# EAGLE design Focus_V8 (EAGLE 6.6.0)
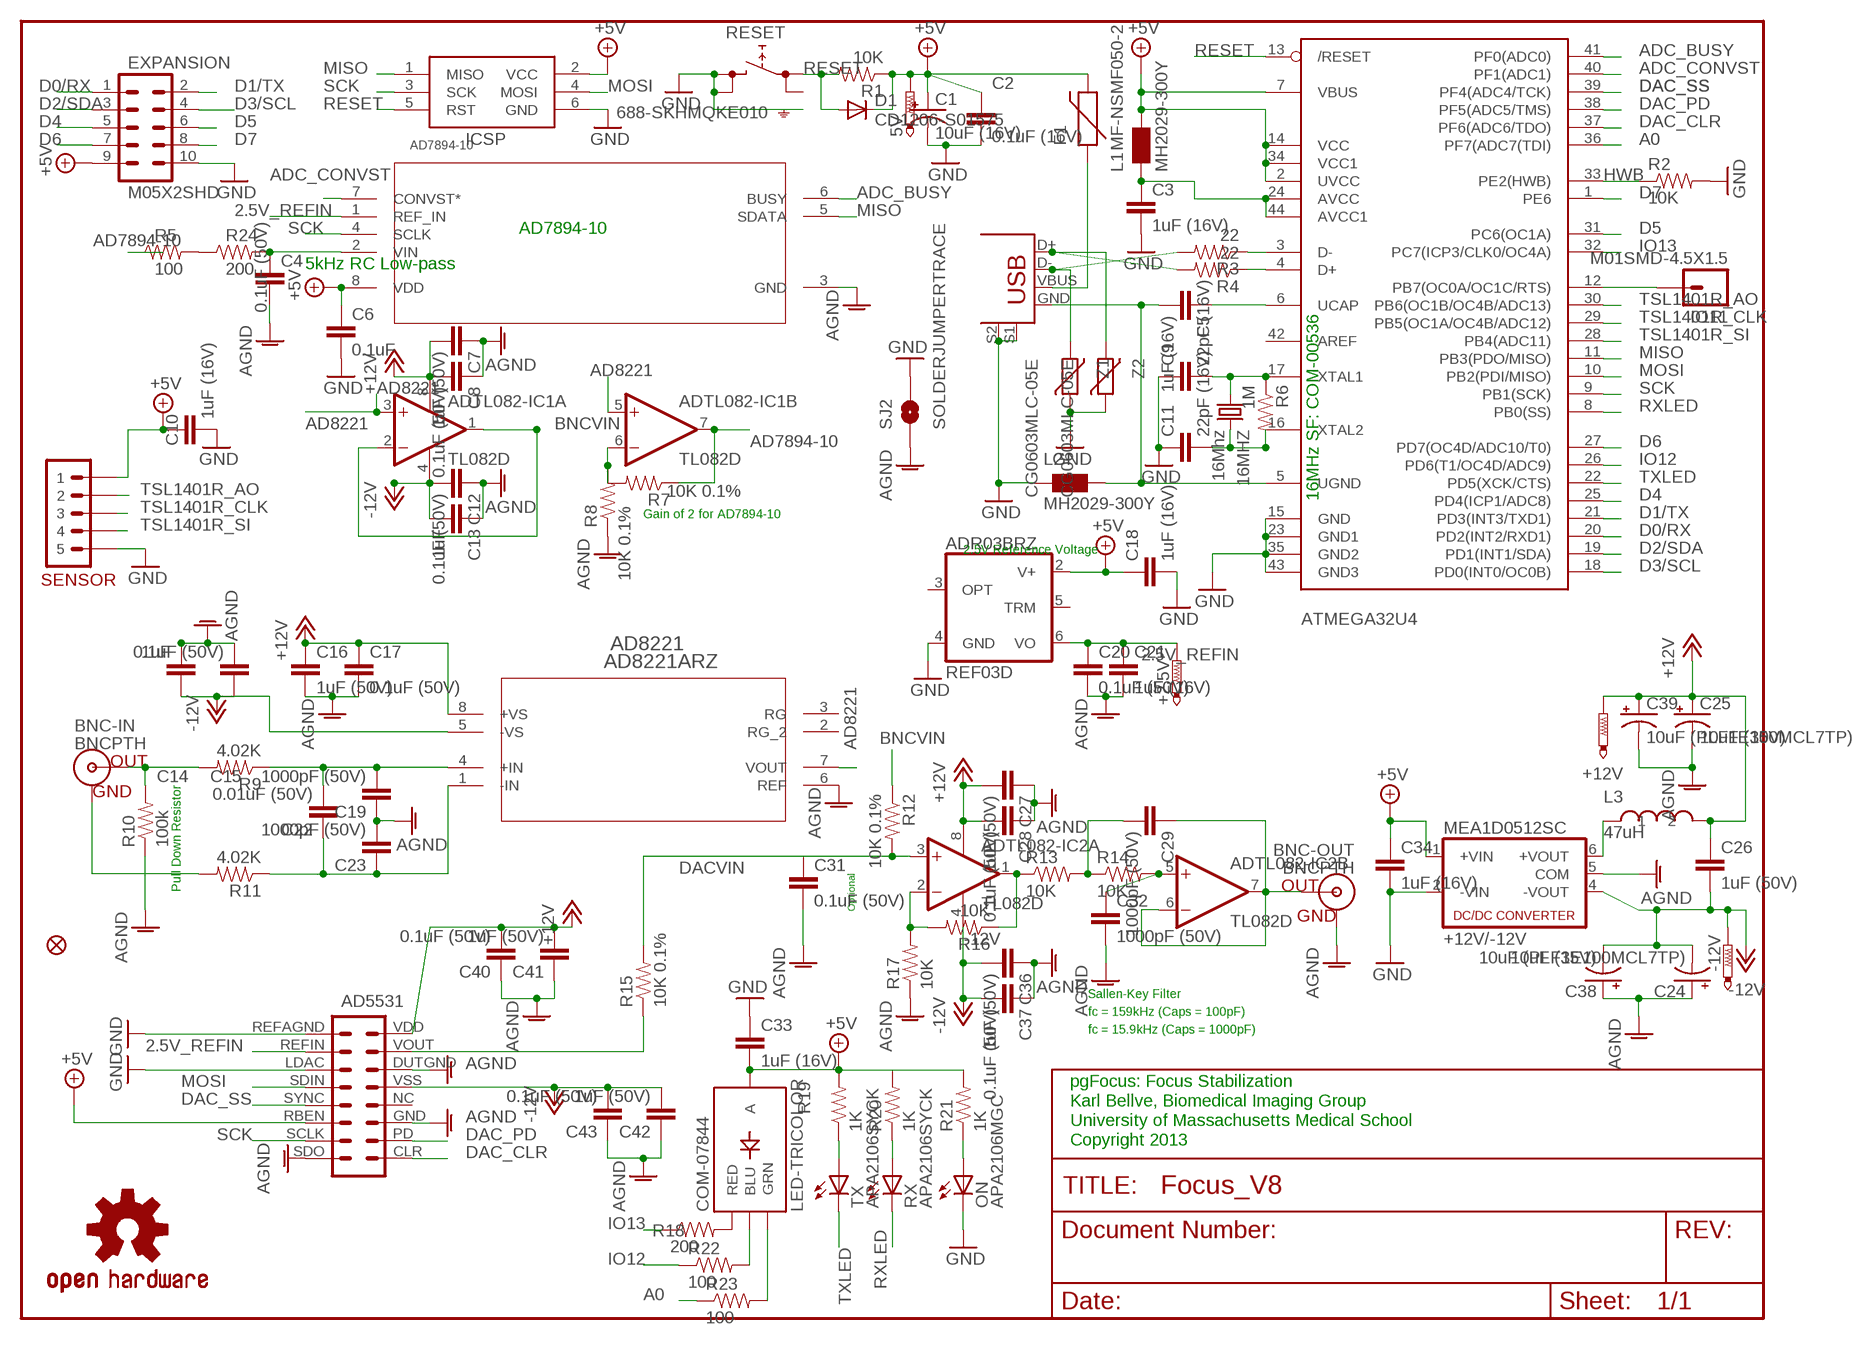
[diagram p0: schematic, sheet 1]

## Parts
5V  PTR1TP20R  [TP20R]
16MHZ  16Mhz  CRYSTALHC49UV  [HC49U-V]
+2.5V  PTR1TP20R  [TP20R]
+12V  PTR1TP20R  [TP20R]
-12V  PTR1TP20R  [TP20R]
AD7894-10  AD7894ARZ-10  AD7894ARZ-3  [R_8]
AD8221  AD8221ARZ  [R_8]
ADR03BRZ  REF03D  [SO08]
ADTL082-IC1  TL082D  [SO08]
ADTL082-IC2  TL082D  [SO08]
ATMEGA32U4  ATMEGA32U4-AU  [TQFP44]
BNC-IN  BNCPTH  [BNC]
BNC-OUT  BNCPTH  [BNC]
C1  10uF (16V)  CAP_POL1206-KIT  [EIA3216-KIT]
C2  0.1uF (16V)  CAP0603-CAP  [0603-CAP]
C3  1uF (16V)  CAP0603-CAP  [0603-CAP]
C4  0.1uF (50V)  CAP0603-CAP  [0603-CAP]
C5  1uF (16V)  CAP0603-CAP  [0603-CAP]
C6  0.1uF  CAP0603-CAP  [0603-CAP]
C7  1uF (50V)  CAP0603-CAP  [0603-CAP]
C8  0.1uF (50V)  CAP0603-CAP  [0603-CAP]
C9  22pF (16V)  CAP0603-CAP  [0603-CAP]
C10  1uF (16V)  CAP0603-CAP  [0603-CAP]
C11  22pF (16V)  CAP0603-CAP  [0603-CAP]
C12  0.1uF (50V)  CAP0603-CAP  [0603-CAP]
C13  1uF  CAP0603-CAP  [0603-CAP]
C14  1uF  CAP0603-CAP  [0603-CAP]
C15  0.1uF (50V)  CAP0603-CAP  [0603-CAP]
C16  1uF (50V)  CAP0603-CAP  [0603-CAP]
C17  0.1uF (50V)  CAP0603-CAP  [0603-CAP]
C18  1uF (16V)  CAP0603-CAP  [0603-CAP]
C19  1000pF (50V)  CAP0603-CAP  [0603-CAP]
C20  0.1uF (50V)  CAP0603-CAP  [0603-CAP]
C21  1uF (16V)  CAP0603-CAP  [0603-CAP]
C22  0.01uF (50V)  CAP0603-CAP  [0603-CAP]
C23  1000pF (50V)  CAP0603-CAP  [0603-CAP]
C24  10uF (PLF1E100MCL7TP)  CAP_POLPTH1  [CPOL-RADIAL-100UF-25V]
C25  10uF (35V)  CAP_POL1206-KIT  [EIA3216-KIT]
C26  1uF (50V)  CAP0603-CAP  [0603-CAP]
C27  1uF (50V)  CAP0603-CAP  [0603-CAP]
C28  0.1uF (50V)  CAP0603-CAP  [0603-CAP]
C29  1000pF (50V)  CAP0603-CAP  [0603-CAP]
C31  0.1uF (50V)  CAP0603-CAP  [0603-CAP]
C32  1000pF (50V)  CAP0603-CAP  [0603-CAP]
C33  1uF (16V)  CAP0603-CAP  [0603-CAP]
C34  1uF (16V)  CAP0603-CAP  [0603-CAP]
C36  1uF (50V)  CAP0603-CAP  [0603-CAP]
C37  0.1uF (50V)  CAP0603-CAP  [0603-CAP]
C38  10uF (35V)  CAP_POL1206-KIT  [EIA3216-KIT]
C39  10uF (PLF1E100MCL7TP)  CAP_POLPTH1  [CPOL-RADIAL-100UF-25V]
C40  0.1uF (50V)  CAP0603-CAP  [0603-CAP]
C41  1uF (50V)  CAP0603-CAP  [0603-CAP]
C42  1uF (50V)  CAP0603-CAP  [0603-CAP]
C43  0.1uF (50V)  CAP0603-CAP  [0603-CAP]
COM-07844  LED-TRICOLOR  [LED-TRICOLOR-SMD]
D1  CD1206-S01575  DIODE-MINIMELF  [MINIMELF]
EXPANSION  M05X2SHD  [2X5-SHROUDED]
F1  MF-NSMF050-2  PTCSMD  [PTC-1206]
ICSP  AVRISP-6  [AVRISP]
IO11  M01SMD-4.5X1.5  [PAD-1.5X4.5]
JP1  FIDUCIAL1.5X3  [FIDUCIAL-1.5X3]
L1  MH2029-300Y  WE-CBF_0805  [0805]
L2  MH2029-300Y  WE-CBF_0805  [0805]
L3  47uH  11R473C  [11R473C]
MEA1D0512SC  +12V/-12V  NMA  [NMA]
ON  APA2106MGC  LEDCHIPLED_0805  [CHIPLED_0805]
R1  10K  RESISTOR0603-RES  [0603-RES]
R2  10K  RESISTOR0603-RES  [0603-RES]
R3  22  RESISTOR0603-RES  [0603-RES]
R4  22  RESISTOR0603-RES  [0603-RES]
R5  100  RESISTOR0603-RES  [0603-RES]
R6  1M  RESISTOR0603-RES  [0603-RES]
R7  10K 0.1%  RESISTOR0603-RES  [0603-RES]
R8  10K 0.1%  RESISTOR0603-RES  [0603-RES]
R9  4.02K  RESISTOR0603-RES  [0603-RES]
R10  100k  RESISTOR0603-RES  [0603-RES]
R11  4.02K  RESISTOR0603-RES  [0603-RES]
R12  10K 0.1%  RESISTOR0603-RES  [0603-RES]
R13  10K  RESISTOR0603-RES  [0603-RES]
R14  10K  RESISTOR0603-RES  [0603-RES]
R15  10K 0.1%  RESISTOR0603-RES  [0603-RES]
R16  10K  RESISTOR0603-RES  [0603-RES]
R17  10K  RESISTOR0603-RES  [0603-RES]
R18  200  RESISTOR0603-RES  [0603-RES]
R19  1K  RESISTOR0603-RES  [0603-RES]
R20  1K  RESISTOR0603-RES  [0603-RES]
R21  1K  RESISTOR0603-RES  [0603-RES]
R22  100  RESISTOR0603-RES  [0603-RES]
R23  100  RESISTOR0603-RES  [0603-RES]
R24  200  RESISTOR0603-RES  [0603-RES]
RESET  688-SKHMQKE010  SKHMPSE010  [SKHMPXE010]
RX  APA2106SYCK  LEDCHIPLED_0805  [CHIPLED_0805]
SENSOR  M05  [M05JST-PTH]
SJ2  SOLDERJUMPERTRACE  [SJ_2S-TRACE]
TX  APA2106SYCK  LEDCHIPLED_0805  [CHIPLED_0805]
U$1  AD5531  AD5331  [AD5531]
U$3  OSHW-LOGOL  [OSHW-LOGO-L]
USB  USB+SHIELD  [USB-B-PTH]
Z1  CG0603MLC-05E  VARISTORCN0603  [CT/CN0603]
Z2  CG0603MLC-05E  VARISTORCN0603  [CT/CN0603]

## Nets
2.5V_REFIN: +2.5V.TP AD7894-10.1(REF_IN) ADR03BRZ.6(VO) C20.1 C21.1 U$1.REFIN
+5V: 5V.TP AD7894-10.8(VDD) ADR03BRZ.2(V+) ATMEGA32U4.2(UVCC) ATMEGA32U4.7(VBUS) ATMEGA32U4.14(VCC) ATMEGA32U4.34(VCC1) C1.A(+) C2.1 C6.1 C10.1 C18.1 C33.2 C34.1 COM-07844.A D1.C EXPANSION.9 F1.2 ICSP.2(VCC) L1.2 MEA1D0512SC.1(+VIN) R1.1 R19.2 R20.2 R21.2 SENSOR.P$1 U$1.RBEN
+12V: +12V.TP AD8221.8(+VS) ADTL082-IC1.8(P:V+) ADTL082-IC2.8(P:V+) C7.2 C8.2 C16.1 C17.1 C25.A(+) C26.1 C27.2 C28.2 C39.1(+) C40.2 C41.2 L3.P$2 U$1.VDD
-12V: -12V.TP AD8221.5(-VS) ADTL082-IC1.4(P:V-) ADTL082-IC2.4(P:V-) C12.2 C13.2 C14.1 C15.1 C24.2(-) C26.2 C36.2 C37.2 C38.C(-) C42.2 C43.2 MEA1D0512SC.4(-VOUT) U$1.VSS
A0: ATMEGA32U4.36(PF7(ADC7(TDI)) R23.1
AD7894-10: ADTL082-IC1.7(B:OUT) R5.1 R7.1
AD8221: AD8221.7(VOUT) ADTL082-IC1.3(A:+IN) ADTL082-IC1.5(B:+IN)
ADC_BUSY: AD7894-10.6(BUSY) ATMEGA32U4.41(PF0(ADC0))
ADC_CONVST: AD7894-10.7(CONVST*) ATMEGA32U4.40(PF1(ADC1))
AGND: AD7894-10.3(GND) AD8221.6(REF) BNC-OUT.GND C4.2 C7.1 C8.1 C12.1 C13.1 C14.2 C15.2 C16.2 C17.2 C19.1 C20.2 C21.2 C23.2 C24.1(+) C25.C(-) C27.1 C28.1 C31.2 C32.2 C36.1 C37.1 C38.A(+) C39.2(-) C40.1 C41.1 C42.1 C43.1 MEA1D0512SC.5(COM) R8.1 R10.1 R17.1 SJ2.1 U$1.DUTGND U$1.GND U$1.SDO
BNCVIN: ADTL082-IC1.1(A:OUT) ADTL082-IC1.2(A:-IN) R12.1
D0/RX: ATMEGA32U4.20(PD2(INT2/RXD1)) EXPANSION.1
D1/TX: ATMEGA32U4.21(PD3(INT3/TXD1)) EXPANSION.2
D2/SDA: ATMEGA32U4.19(PD1(INT1/SDA)) EXPANSION.3
D3/SCL: ATMEGA32U4.18(PD0(INT0/OC0B)) EXPANSION.4
D4: ATMEGA32U4.25(PD4(ICP1/ADC8)) EXPANSION.5
D5: ATMEGA32U4.31(PC6(OC1A)) EXPANSION.6
D6: ATMEGA32U4.27(PD7(OC4D/ADC10/T0)) EXPANSION.7
D7: ATMEGA32U4.1(PE6) EXPANSION.8
DAC_CLR: ATMEGA32U4.37(PF6(ADC6/TDO)) U$1.CLR
DAC_PD: ATMEGA32U4.38(PF5(ADC5/TMS)) U$1.PD
DAC_SS: ATMEGA32U4.39(PF4(ADC4/TCK)) U$1.SYNC
DACVIN: ADTL082-IC2.3(A:+IN) C31.1 R12.2 R15.2
GND: ADR03BRZ.4(GND) ATMEGA32U4.15(GND) ATMEGA32U4.23(GND1) ATMEGA32U4.35(GND2) ATMEGA32U4.43(GND3) C1.C(-) C2.2 C3.2 C6.2 C9.1 C10.2 C11.1 C18.2 C33.1 C34.2 EXPANSION.10 ICSP.6(GND) L2.1 MEA1D0512SC.2(-VIN) ON.CATHODE(C) R2.2 RESET.3(2.1) RESET.4(2.2) RESET.5(SH) SENSOR.P$5 SJ2.2 U$1.LDAC U$1.REFAGND USB.S1 USB.S2 Z1.1 Z2.1
HWB: ATMEGA32U4.33(PE2(HWB)) R2.1
IO12: ATMEGA32U4.26(PD6(T1/OC4D/ADC9)) R22.1
IO13: ATMEGA32U4.32(PC7(ICP3/CLK0/OC4A)) R18.1
MISO: AD7894-10.5(SDATA) ATMEGA32U4.11(PB3(PDO/MISO)) ICSP.1(MISO)
MOSI: ATMEGA32U4.10(PB2(PDI/MISO)) ICSP.4(MOSI) U$1.SDIN
N$1: ADTL082-IC2.2(A:-IN) R16.2 R17.2
N$2: ADTL082-IC2.5(B:+IN) C32.1 R14.2
N$3: AD7894-10.2(VIN) C4.1 R24.2
N$4: AD8221.1(-IN) C22.1 C23.1 R11.1
N$5: R5.2 R24.1
N$6: L3.P$1 MEA1D0512SC.6(+VOUT)
N$7: ADTL082-IC2.1(A:OUT) R13.1 R16.1
N$8: R15.1 U$1.VOUT
N$9: R19.1 TX.ANODE(A)
N$10: ATMEGA32U4.4(D+) R4.1
N$11: 16MHZ.1 ATMEGA32U4.17(XTAL1) C9.2 R6.1
N$12: R20.1 RX.ANODE(A)
N$13: BNC-IN.GND R11.2
N$14: AD8221.4(+IN) C19.2 C22.2 R9.1
N$15: ATMEGA32U4.6(UCAP) C5.1
N$16: C29.2 R13.2 R14.1
N$17: BNC-IN.S(OUT) R9.2 R10.2
N$18: ADTL082-IC1.6(B:-IN) R7.2 R8.2
N$19: R3.2 USB.D- Z1.2
N$20: ATMEGA32U4.3(D-) R3.1
N$21: R4.2 USB.D+ Z2.2
N$22: F1.1 USB.VBUS
N$23: ADTL082-IC2.6(B:-IN) ADTL082-IC2.7(B:OUT) BNC-OUT.S(OUT) C29.1
N$24: ON.ANODE(A) R21.1
N$25: ATMEGA32U4.24(AVCC) ATMEGA32U4.44(AVCC1) C3.1 L1.1
N$26: 16MHZ.2 ATMEGA32U4.16(XTAL2) C11.2 R6.2
N$28: ATMEGA32U4.12(PB7(OC0A/OC1C/RTS)) IO11.P$1
N$29: COM-07844.R(RED) R18.2
N$30: COM-07844.B(BLU) R22.2
N$31: COM-07844.G(GRN) R23.2
RESET: ATMEGA32U4.13(/RESET) D1.A ICSP.5(RST) R1.2 RESET.1(1.1)
RXLED: ATMEGA32U4.8(PB0(SS)) RX.CATHODE(C)
SCK: AD7894-10.4(SCLK) ATMEGA32U4.9(PB1(SCK)) ICSP.3(SCK) U$1.SCLK
TSL1401R_AO: ATMEGA32U4.30(PB6(OC1B/OC4B/ADC13)) SENSOR.P$2
TSL1401R_CLK: ATMEGA32U4.29(PB5(OC1A/OC4B/ADC12)) SENSOR.P$3
TSL1401R_SI: ATMEGA32U4.28(PB4(ADC11)) SENSOR.P$4
TXLED: ATMEGA32U4.22(PD5(XCK/CTS)) TX.CATHODE(C)
UGND: ATMEGA32U4.5(UGND) C5.2 L2.2 USB.GND
Unconnected: AD8221.2(RG_2) AD8221.3(RG) ADR03BRZ.3(OPT) ADR03BRZ.5(TRM) ATMEGA32U4.42(AREF) RESET.2(1.2) U$1.NC

## Notes on the sheet
- AD7894-10
- 5kHz RC Low-pass
- 16MHz SF: COM-00536
- Gain of 2 for AD7894-10
- 2.5V Reference Voltage
- Pull Down Resistor
- Optional
- Sallen-Key Filter
- fc = 159kHz (Caps = 100pF)
- fc = 15.9kHz (Caps = 1000pF)
- pgFocus: Focus Stabilization
- Karl Bellve, Biomedical Imaging Group
- University of Massachusetts Medical School
- Copyright 2013

## Library data of the parts
5V +2.5V +12V -12V = testpad:PTR1: TEST PIN
16MHZ = SparkFun:CRYSTAL: Crystals Various standard crystals. Proven footprints. Spark Fun Electronics SKU : COM-00534
AD7894-10 = BIG:AD7894ARZ-3; MANUFACTURER_PART_NUMBER: AD7894ARZ-3; VENDOR: Vendor
AD8221 = BIG:AD8221ARZ
ADR03BRZ = linear:REF03: VOLTAGE REFERENCE
ADTL082-IC1 ADTL082-IC2 = linear:TL082: OP AMP
ATMEGA32U4 = adafruit:ATMEGA32U4: http://www.ladyada.net/library/eagle
BNC-IN BNC-OUT = SparkFun:BNC: BNC Connector, Mouser Part# 5227161
C1 C25 C38 = SparkFun:CAP_POL: Capacitor Polarized These are standard SMD and PTH capacitors. Normally 10uF, 47uF, and 100uF in electrolytic and tantalum varieties. Always verify the external diameter of the through hole cap, it varies with capacity, voltage, and manufacturer. The EIA devices should be standard.
C2-C23 C26-C29 C31-C34 C36 C37 C40-C43 = SparkFun:CAP: Capacitor Standard 0603 ceramic capacitor, and 0.1" leaded capacitor.
C24 C39 = SparkFun-Passives:CAP_POL: Capacitor Polarized These are standard SMD and PTH capacitors. Normally 10uF, 47uF, and 100uF in electrolytic and tantalum varieties. Always verify the external diameter of the through hole cap, it varies with capacity, voltage, and manufacturer. The EIA devices should be standard.
COM-07844 = SparkFun-LED:LED-TRICOLOR: Tri-Color LED SMD Proven layout and schematic for triple color LED in SMD package - common anode. Spark Fun Electronics SKU : COM-07844
D1 = diode:DIODE-: DIODE
EXPANSION = SparkFun-Connectors:M05X2: Header 5x2 Standard 10-pin dual row 0.1" header. Commonly used with AVR-ISP. Use with Spark Fun Electronics SKU: PRT-00778
F1 = SparkFun:PTC: Resettable Fuse PTC Resettable Fuse. Spark Fun Electronics SKU : COM-08357
ICSP = adafruit:AVRISP: AVR ISP HEADER Standard 6 pin header for AVR programming
IO11 = SparkFun-Connectors:M01: Header 1 Standard 1-pin 0.1" header. Use with straight break away headers (SKU : PRT-00116), right angle break away headers (PRT-00553), swiss pins (PRT-00743), machine pins (PRT-00117), and female headers (PRT-00115).
JP1 = SparkFun:FIDUCIAL: Fiducial Alignment Points Various fiducial points for machine vision alignment.
L1 L2 = wuerth-elektronik:WE-CBF: SMD EMI Suppression Ferrite Beads - excellent anti-EMI properties - low DCR - impedances till 3000 ohms - rated current up to 6 A
L3 = BIG:11R473C: 47 uF inductor
MEA1D0512SC = dc-dc-converter:NMA: DC-DC CONVERTER; MF: C & D TECHNOLOGIES, INC; MPN: NMA0515SC; OC_FARNELL: 1021434; OC_NEWARK: 61K3064
ON RX TX = BIG:LED: LED OSRAM: - CHIPLED LG R971, LG N971, LY N971, LG Q971, LY Q971, LO R971, LY R971 LH N974, LH R974 LS Q976, LO Q976, LY Q976 LO Q996 - Hyper CHIPLED LW Q18S LB Q993, LB Q99A, LB R99A - SideLED LS A670, LO A670, LY A670, LG A670, LP A670 LB A673, LV A673, LT A673, LW A673 LH A674 LY A675 LS A676, LA A676, LO A676, LY A676, LW A676 LS A679, LY A679, LG A679 - Hyper Micro SIDELED® LS Y876, LA Y876, LO Y876, LY Y876 LT Y87S - SmartLED LW L88C, LW L88S LB L89C, LB L89S, LG L890 LS L89K, LO L89K, LY L89K LS L896, LA L896, LO L896, LY L896 - TOPLED LS T670, LO T670, LY T670, LG T670, LP T670 LSG T670, LSP T670, LSY T670, LOP T670, LYG T670 LG T671, LOG T671, LSG T671 LB T673, LV T673, LT T673, LW T673 LH T674 LS T676, LA T676, LO T676, LY T676, LB T676, LH T676, LSB T676, LW T676 LB T67C, LV T67C, LT T67C, LS T67K, LO T67K, LY T67K, LW E67C LS E67B, LA E67B, LO E67B, LY E67B, LB E67C, LV E67C, LT E67C LW T67C LS T679, LY T679, LG T679 LS T770, LO T770, LY T770, LG T770, LP T770 LB T773, LV T773, LT T773, LW T773 LH T774 LS E675, LA E675, LY E675, LS T675 LS T776, LA T776, LO T776, LY T776, LB T776 LHGB T686 LT T68C, LB T68C - Hyper Mini TOPLED® LB M676 - Mini TOPLED Santana® LG M470 LS M47K, LO M47K, LY M47K Source: http://www.osram.convergy.de LUXEON: - LUMILED® LXK2-PW12-R00, LXK2-PW12-S00, LXK2-PW14-U00, LXK2-PW14-V00 LXK2-PM12-R00, LXK2-PM12-S00, LXK2-PM14-U00 LXK2-PE12-Q00, LXK2-PE12-R00, LXK2-PE12-S00, LXK2-PE14-T00, LXK2-PE14-U00 LXK2-PB12-K00, LXK2-PB12-L00, LXK2-PB12-M00, LXK2-PB14-N00, LXK2-PB14-P00, LXK2-PB14-Q00 LXK2-PR12-L00, LXK2-PR12-M00, LXK2-PR14-Q00, LXK2-PR14-R00 LXK2-PD12-Q00, LXK2-PD12-R00, LXK2-PD12-S00 LXK2-PH12-R00, LXK2-PH12-S00 LXK2-PL12-P00, LXK2-PL12-Q00, LXK2-PL12-R00 Source: www.luxeon.com KINGBRIGHT: KA-3528ASYC Source: www.kingbright.com
R1-R24 = SparkFun:RESISTOR: Resistor Basic schematic elements and footprints for 0603, 1206, and PTH resistors.
RESET = switch:SKHMP*E010: 6.2 X 6.5mm TACT Switch (SMD) Source: http://www3.alps.co.jp/WebObjects/catalog.woa/PDF/E/Switch/Tact/SKHM/SKHM.PDF
SENSOR = BIG:M05
SJ2 = SparkFun-Passives:SOLDERJUMPER: Solder Jumper Standard SMD solder jumper. Used to automate production. Two varients : Normally Open and Normally Closed are the same, but have different paste layers. NC will have a large amount of paste and should jumper during reflow.
U$1 = BIG:AD5331: The AD5530/AD5531 are single 12- and 14-bit (respectively) serial input, voltage output digital-to-analog converters (DAC).
U$3 = SparkFun:OSHW-LOGO: Open Source Hardware Logo This logo indicates the piece of hardware it is found on incorporates a OSHW license and/or adheres to the definition of open source hardware found here: http://freedomdefined.org/OSHW
USB = SparkFun:USB+SHIELD: USB+Shield USB connector with shield pins connectable
Z1 Z2 = varistor:VARISTOR: VARISTOR

## Board
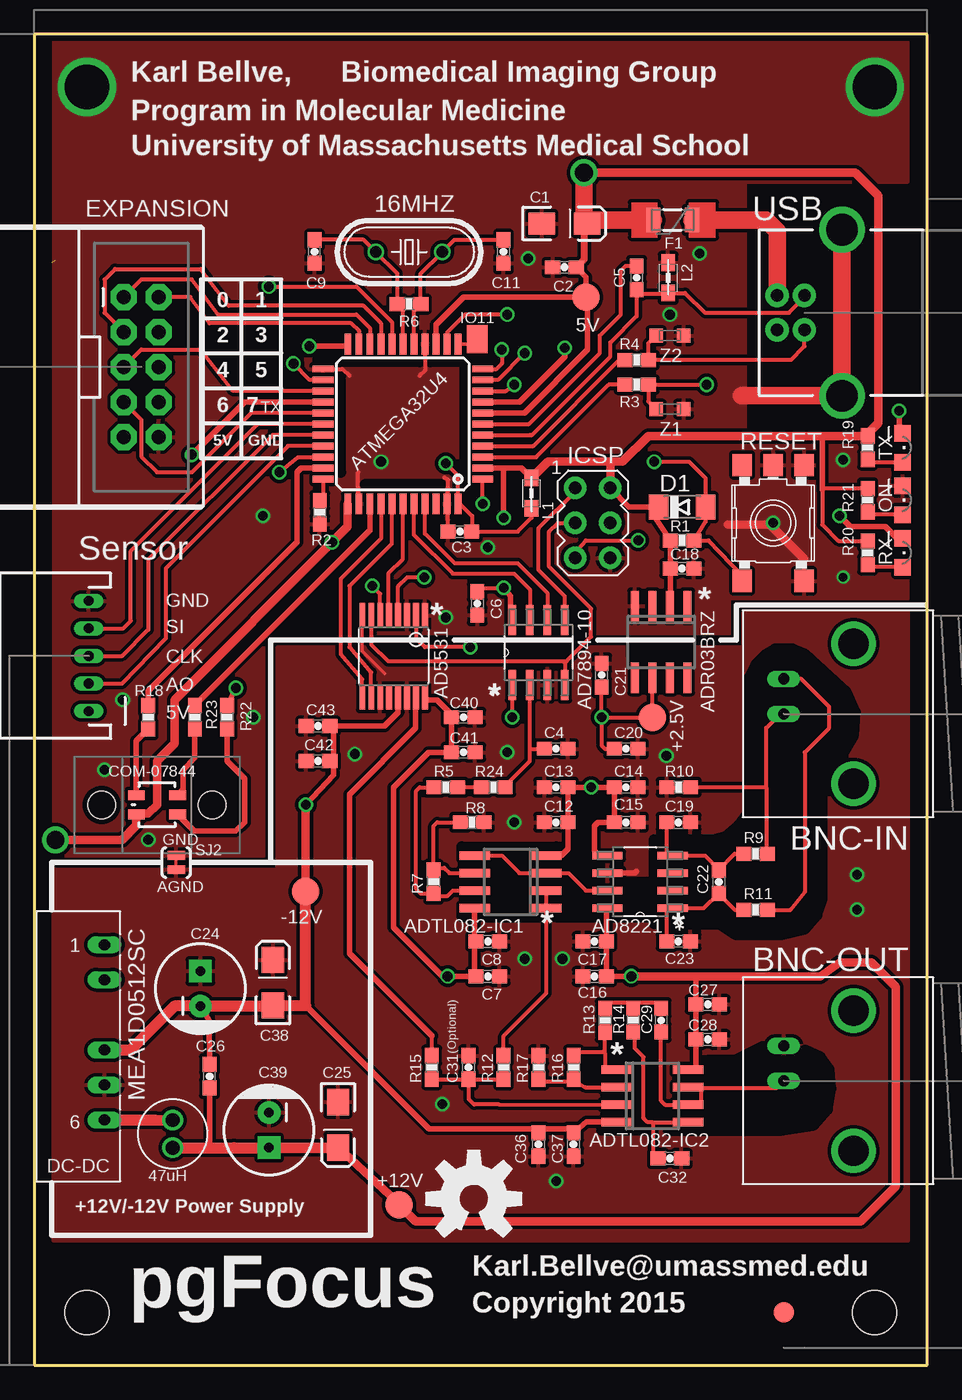
[diagram p1: board, top side]
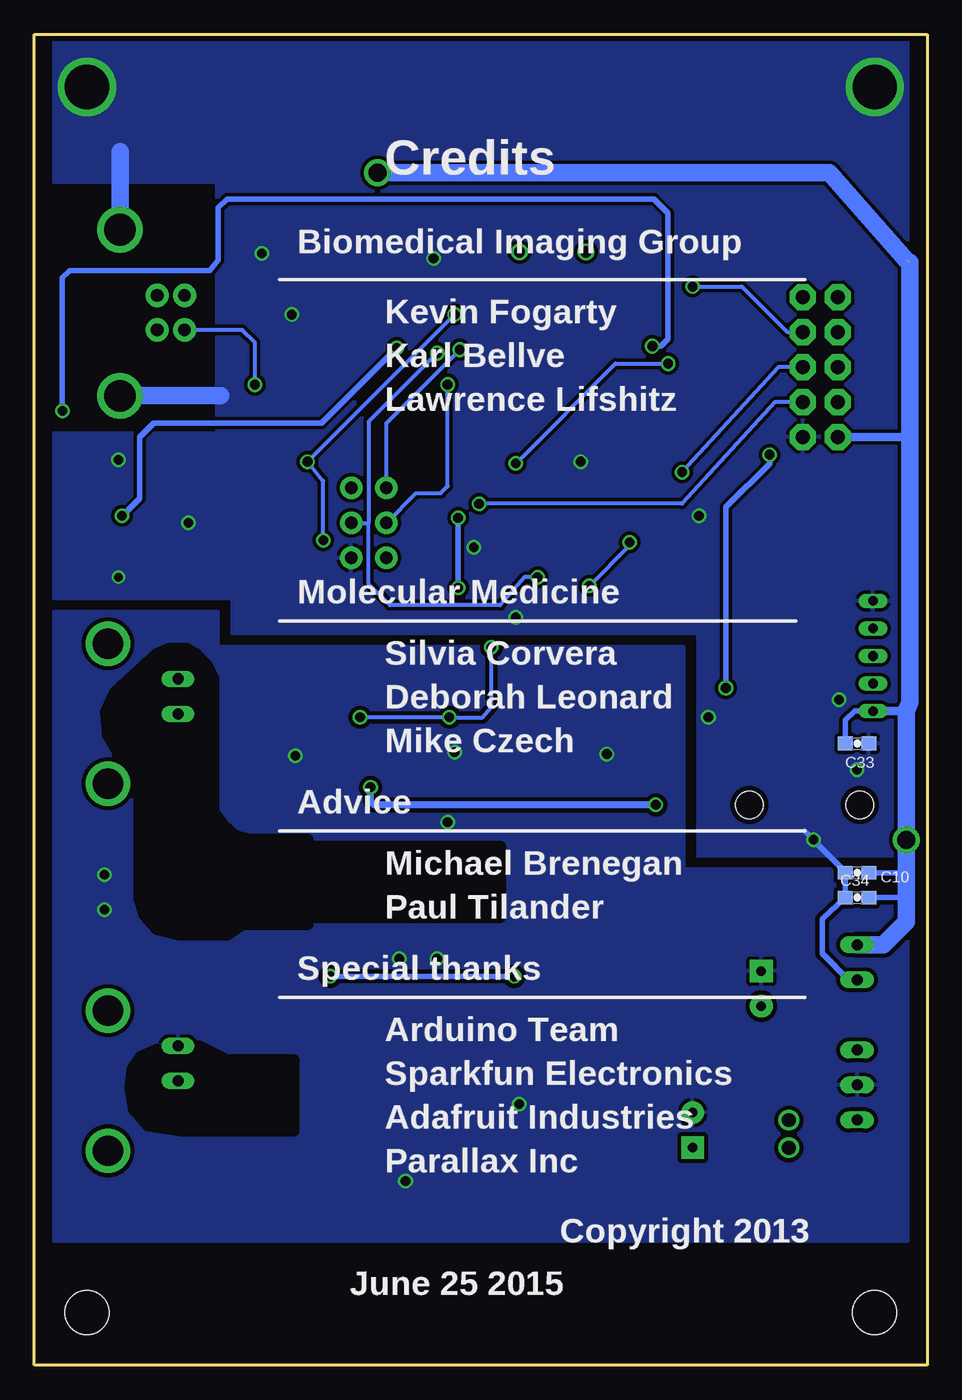
[diagram p2: board, bottom side, seen from below]

Size 64.77 x 96.52 mm. Coordinates in mm from the lower left corner, seen from the top.
Outline: 0,0 64.77,0 64.77,96.52 0,96.52 0,0
Copper layers (1*16): Top 0.0356mm / dielectric 1.5011mm / Bottom 0.0356mm
Design rules "LaenPCBOrder *": minimum track width 6mil, minimum drill 13mil, track to track 6mil, track to pad 6mil, pad to pad 6mil, via to via 6mil, smd to smd 6mil, copper to edge 15mil, drill to drill 6mil, minimum pad ring 7mil, minimum via ring 7mil, stop-mask expansion 4mil, vias tented up to drill 28mil, thermal gap 10mil
Holes 3.2 mm at 3.81,3.81 60.96,3.81
tRestrict: 53 lines
bRestrict: 39 lines

### Footprints (pad centres in the part's own frame; a part is rotated, then mirrored left to right if it is on the bottom)
TP20R = smd 2 x 2: TP 0,0
HC49U-V = drill 0.813: 1 -2.413,0; 2 2.413,0
R_8 = smd 2.184 x 0.559: 1 -2.362,1.905; 2 -2.362,0.635; 3 -2.362,-0.635; 4 -2.362,-1.905; 5 2.362,-1.905; 6 2.362,-0.635; 7 2.362,0.635; 8 2.362,1.905
SO08 = smd 0.6 x 2.2: 1 -1.905,-2.6; 2 -0.635,-2.6; 3 0.635,-2.6; 4 1.905,-2.6; 5 1.905,2.6; 6 0.635,2.6; 7 -0.635,2.6; 8 -1.905,2.6
TQFP44 = smd 1.5 x 0.5: 1 -5.8,4; 2 -5.8,3.2; 3 -5.8,2.4; 4 -5.8,1.6; 5 -5.8,0.8; 6 -5.8,0; 7 -5.8,-0.8; 8 -5.8,-1.6; 9 -5.8,-2.4; 10 -5.8,-3.2; 11 -5.8,-4; 23 5.8,-4; 24 5.8,-3.2; 25 5.8,-2.4; 26 5.8,-1.6; 27 5.8,-0.8; 28 5.8,0; 29 5.8,0.8; 30 5.8,1.6; 31 5.8,2.4; 32 5.8,3.2; 33 5.8,4 | smd 0.5 x 1.5: 12 -4,-5.8; 13 -3.2,-5.8; 14 -2.4,-5.8; 15 -1.6,-5.8; 16 -0.8,-5.8; 17 0,-5.8; 18 0.8,-5.8; 19 1.6,-5.8; 20 2.4,-5.8; 21 3.2,-5.8; 22 4,-5.8; 34 4,5.8; 35 3.2,5.8; 36 2.4,5.8; 37 1.6,5.8; 38 0.8,5.8; 39 0,5.8; 40 -0.8,5.8; 41 -1.6,5.8; 42 -2.4,5.8; 43 -3.2,5.8; 44 -4,5.8
BNC = drill 2.2: 3 -5.08,5.08; 4 5.08,5.08 | drill 0.8 long: GND -2.54,0; S 0,0
EIA3216-KIT = smd 1.9 x 1.6: A 1.65,0; C -1.65,0
0603-CAP = smd 1.1 x 1: 1 -0.85,0; 2 0.85,0
CPOL-RADIAL-100UF-25V = drill 0.7 pad 1.651 square: 1 1.27,0 | drill 0.7 pad 1.651: 2 -1.27,0
LED-TRICOLOR-SMD = smd 0.7 x 1.2: A 0.7,-1.5; B 0.7,1.5; G -0.7,1.5; R -0.7,-1.5
MINIMELF = smd 1.4 x 1.8: A 1.7,0; C -1.7,0
2X5-SHROUDED = drill 1.016 pad 1.88 octagon: 1 -1.27,5.08; 2 1.27,5.08; 3 -1.27,2.54; 4 1.27,2.54; 5 -1.27,0; 6 1.27,0; 7 -1.27,-2.54; 8 1.27,-2.54; 9 -1.27,-5.08; 10 1.27,-5.08
PTC-1206 = smd 1 x 1.8: 1 -1.4,0; 2 1.4,0
AVRISP = drill 0.9 pad 1.626: 1 -1.27,2.54; 2 1.27,2.54; 3 -1.27,0; 4 1.27,0; 5 -1.27,-2.54; 6 1.27,-2.54
PAD-1.5X4.5 = smd 1.5 x 2: P$1 0,0
FIDUCIAL-1.5X3 = smd 1.5 x 1.5: 1 0,0
0805 = smd 1.2 x 1: 1 -1.1,0; 2 1.1,0
11R473C = drill 1: P$1 -1,0; P$2 1,0
NMA = drill 0.813 long: 1 0,6.35; 2 0,3.81; 4 0,-1.27; 5 0,-3.81; 6 0,-6.35
CHIPLED_0805 = smd 1.2 x 1.2: ANODE 0,-1.05; CATHODE 0,1.05
0603-RES = smd 1.1 x 1: 1 -0.85,0; 2 0.85,0
SKHMPXE010 = smd 1.6 x 1.4: 1 -4.2,2.25; 2 4.2,2.25; 3 -4.2,-2.25; 4 4.2,-2.25; 5 4.2,0
M05JST-PTH = drill 0.7 long: P$1 0,-4; P$2 0,-2; P$3 0,0; P$4 0,2; P$5 0,4
SJ_2S-TRACE = smd 0.635 x 1.27: 1 -0.508,0; 2 0.508,0
AD5531 = smd 0.42 x 1.78: CLR 2.275,2.97; DUTGND -0.975,2.97; GND 0.975,2.97; LDAC -0.975,-2.97; NC 0.325,2.97; PD 1.625,2.97; RBEN 0.975,-2.97; REFAGND -2.275,-2.97; REFIN -1.625,-2.97; SCLK 1.625,-2.97; SDIN -0.325,-2.97; SDO 2.275,-2.97; SYNC 0.325,-2.97; VDD -2.275,2.97; VOUT -1.625,2.97; VSS -0.325,2.97
SMD-22 = hole 2: 0,4; 0,-4
USB-B-PTH = drill 0.914 pad 1.676: D+ 0,1.25; D- 1.981,1.25; GND 0,-1.25; VBUS 1.981,-1.25 | drill 2.286: S1 -2.718,-6.02; S2 -2.718,6.02
CT/CN0603 = smd 1 x 1: 1 -1,0; 2 1,0

### Placement (x,y rotation side)
5V  40,77.47 0 top
16MHZ  27.18,80.74 0 top
+2.5V  44.83,46.99 0 top
+12V  26.47,11.61 270 top
-12V  19.68,34.34 0 top
AD7894-10  36.58,51.69 90 top
AD8221  43.94,35.05 180 top
ADR03BRZ  45.47,52.45 180 top
ADTL082-IC1  34.54,35.05 90 top
ADTL082-IC2  44.83,19.52 270 top
ATMEGA32U4  26.73,68.26 180 top
BNC-IN  54.36,47.24 270 top
BNC-OUT  54.36,20.62 270 top
C1  38.46,82.8 0 top
C2  38.46,79.63 180 top
C3  30.86,60.45 180 top
C4  37.85,44.7 0 top
C5  43.69,78.87 270 top
C6  32.13,55.24 270 top
C7  32.89,28.19 180 top
C8  32.89,30.73 180 top
C9  20.32,80.77 90 top
C10  5.08,35.71 180 bottom
C11  34.04,80.77 90 top
C12  37.85,39.37 0 top
C13  37.85,41.91 0 top
C14  42.93,41.91 0 top
C15  42.93,39.37 0 top
C16  40.64,28.19 180 top
C17  40.64,30.73 180 top
C18  46.99,57.78 0 top
C19  46.74,39.37 180 top
C20  42.93,44.7 0 top
C21  41.15,50.04 90 top
C22  49.66,35.05 90 top
C23  46.74,30.73 0 top
C24  12.04,27.3 90 top
C25  22.02,17.42 270 top
C26  12.7,20.95 90 top
C27  48.84,26.16 180 top
C28  48.84,23.62 180 top
C29  45.47,25.02 90 top
C31  31.5,21.59 90 top
C32  46.1,14.99 0 top
C33  5.08,45.09 180 bottom
C34  5.08,33.91 180 bottom
C36  36.58,16 90 top
C37  39.12,16 90 top
C38  17.3,27.74 90 top
C39  17.02,17.04 270 top
C40  31.11,46.99 180 top
C41  31.11,44.45 180 top
C42  20.57,43.81 0 top
C43  20.57,46.35 0 top
COM-07844  8.89,40.64 270 top
D1  46.99,62.23 0 top
EXPANSION  7.75,72.39 0 top
F1  46.3,83.06 180 top
ICSP  40.51,61.09 0 top
IO11  32.13,74.42 180 top
JP1  54.36,3.81 0 top
L1  36.07,63.25 90 top
L2  45.97,78.87 270 top
L3  10.03,16.76 270 top
MEA1D0512SC  5.08,24.13 0 top
ON  62.99,62.74 0 top
R1  46.99,59.82 0 top
R2  20.7,61.85 270 top
R3  43.69,71.12 0 top
R4  43.69,72.9 0 top
R5  29.84,41.91 0 top
R6  27.18,76.96 0 top
R7  28.96,35.05 90 top
R8  31.75,39.37 180 top
R9  52.32,37.08 0 top
R10  46.74,41.91 0 top
R11  52.32,33.02 0 top
R12  34.04,21.59 270 top
R13  41.4,25 90 top
R14  43.43,25.02 270 top
R15  28.83,21.59 270 top
R16  39.12,21.59 270 top
R17  36.58,21.59 270 top
R18  8.25,46.99 270 top
R19  60.45,66.55 90 top
R20  60.45,58.93 90 top
R21  60.45,62.74 90 top
R22  13.97,46.99 270 top
R23  11.63,46.99 270 top
R24  33.3,41.91 0 top
RESET  53.59,61.09 90 top
RX  62.99,58.93 0 top
SENSOR  3.94,51.44 0 top
SJ2  10.29,36.45 90 top
TX  62.99,66.55 0 top
U$1  26.06,51.41 180 top
U$2  [SMD-22]  8.89,40.64 90 top
U$3  31.88,12.07 0 top
USB  55.86,76.34 180 top
Z1  46.1,69.34 180 top
Z2  46.1,74.68 180 top

### Tracks (layer width: path | path; a pad name or v marks a point on that pad's centre or on a via)
2.5V_REFIN  (via drill 0.7)
  Top 0.305: v34.67,46.99 AD7894-10.1 | v31.62,52.07 28.32,52.07 27.68,52.71 U$1.REFIN | v41.15,46.99 +2.5V.TP | +2.5V.TP ADR03BRZ.6 | v41.15,46.99 C21.1 | +2.5V.TP 44.83,46.86 | v41.15,46.99 41.15,44.95 41.4,44.7 C20.1
  Bottom 0.305: v41.15,46.99 v34.67,46.99 32.26,46.99 31.62,47.75 v31.62,52.07
+5V  (via drill 0.7, 1.3)  (1 unrouted)
  Top 0.305: 33.86,56.34 32.17,56.34 C6.1 | 57.15,63.5 57.15,60.96 58.33,59.78 R20.2 | 57.15,63.5 57.24,63.59 | 40,78.11 39.37,77.47 5V.TP | R21.2 57.15,63.59 57.15,63.5 | U$1.RBEN 25.09,55.94 v24.51,56.52
  Top 0.406: ATMEGA32U4.2 34.04,65.06 | 34.04,65.06 v34.04,61.47 | AD7894-10.8 34.54,53.8 34.54,55.78 v34.04,56.39 33.86,56.34 | 60.45,67.56 R19.2 | 57.15,67.4 57.15,63.5 | ICSP.2 43.13,62.23 D1.C | ADR03BRZ.2 46.14,55.22 C18.1 R1.1 45.12,61.34 45.12,62.06 | 41.78,65.41 41.91,65.53 | 34.04,65.06 35.35,65.06 L1.2 | ATMEGA32U4.14 29.13,75.49 31.11,77.47 5V.TP 40.13,77.34 40.13,73.66 35.53,69.06 ATMEGA32U4.7 | C2.1 40,78.93 40,78.11 | 7.45,40.01 COM-07844.A
  Top 0.508: 40.39,83.06 39.88,83.19 | 39.88,83.06 39.88,82.76 | 39.88,82.76 C1.A | 39.88,82.76 39.88,80.2 C2.1
  Top 0.61: 41.78,65.41 ICSP.2 | 60.45,67.56 61.21,68.33 61.21,84.84 59.56,86.49 v39.88,86.49 | 45.12,62.06 D1.C | R19.2 57.15,67.4 44.54,67.4 42.67,65.53 41.91,65.53 37.25,65.53 L1.2 | ATMEGA32U4.34 22.73,60.83 v21.59,59.69 10.16,48.26 10.16,45.09 8.89,43.81 8.89,40.64 8.25,40.01 7.45,40.01 | COM-07844.A 7.39,39.14 6.35,38.1 v1.52,38.1
  Top 0.813: 40.39,83.06 39.88,83.06 39.88,83.19
  Top 1.27: 40.39,83.06 F1.2 | v39.88,86.49 39.88,83.19
  Bottom 0.254: v21.59,59.69 21.59,59.44
  Bottom 0.305: 21.59,59.44 v24.51,56.52
  Bottom 0.406: v34.04,61.47 v34.04,56.39 | 1.65,33.91 1.52,34.04 | C10.1 1.68,35.71 1.57,34.31 | 1.57,34.31 1.52,33.66 | C34.1 1.98,33.91 1.57,34.31 | C33.2 5.93,46.77 5.27,47.44 SENSOR.P$1
  Bottom 0.61: 1.52,47.44 SENSOR.P$1 | EXPANSION.9 1.27,67.31
  Bottom 1.27: 1.52,80.14 7.11,86.49 v39.88,86.49 | MEA1D0512SC.1 3.17,30.48 1.52,32.13 1.52,33.66 1.52,34.04 v1.52,38.1 1.52,47.44 1.27,48.07 1.27,67.31 1.27,80.01
+12V  (via drill 0.7)
  Top 0.406: AD8221.8 41.49,33.06 C17.1 C16.1 v43.31,28.19 | ADTL082-IC2.8 47.46,21.46 48.01,21.46 47.99,21.47 C28.2 C27.2 48.01,26.17 48.01,28.19 | 28.38,48.49 U$1.VDD 28.52,48.26 29.21,48.26 30.27,47.2 C40.2 C41.2 28.58,44.45 26.03,41.91 26.03,31.75 29.59,28.19 v29.97,28.19 C7.2 31.94,28.29 31.94,30.73 C8.2 31.94,30.83 ADTL082-IC1.8 | C26.1 12.7,15.76
  Top 0.61: v43.31,28.19 48.01,28.19 57.02,28.19 58.42,29.21 60.71,29.21 62.48,27.43 62.48,12.95 59.94,10.41 27.66,10.41 +12V.TP 26.56,11.61 26.7,11.46 | 27.04,11.15 26.7,11.46 | 26.7,11.46 C25.A
  Top 0.813: L3.P$2 12.7,15.76 14.47,15.76 C39.1 C25.A
  Bottom 0.406: v29.97,28.19 v43.31,28.19
-12V  (via drill 0.7)
  Top 0.254: 42.2,17.65 ADTL082-IC2.4
  Top 0.305: 26.36,48.42 U$1.VSS
  Top 0.406: ADTL082-IC1.4 38.23,36.96 38.7,37.43 C12.2 C13.2 v40.39,41.91 C14.1 C15.1 40.89,39.37 40.64,39.12 40.64,37.34 41.02,36.96 AD8221.5 | 42.2,17.65 40.04,17.65 C37.2 | 21.72,44.23 C42.2 21.72,43.78 | 21.72,43.78 21.72,46.19 C43.2 25.4,46.35 26.36,47.32 26.36,48.42 | 21.72,43.78 21.72,42.8 v19.68,40.64 | C36.2 36.58,16.89 36.83,17.14 | C37.2 39.24,16.89 39.12,17.02 | 36.83,17.14 38.95,17.14 C37.2 | 36.83,17.14 28.63,17.14 19.68,26.09 | C24.2 12.67,25 C26.2
  Top 0.61: v19.68,40.64 -12V.TP
  Top 0.813: MEA1D0512SC.4 6.98,22.86 10.16,26.04 C24.2 17.25,26.04 C38.C 19.68,26.09 -12V.TP
  Bottom 0.508: v19.68,40.64 40.13,40.64 40.39,40.89 v40.39,41.91
A0
  Top 0.406: ATMEGA32U4.36 24.33,60.53 24.32,60.53 R23.1
AD7894-10
  Top 0.305: ADTL082-IC1.7 30.35,34.42 29.97,34.04 29.25,34.04 | R7.1 28.03,34.2 27.69,34.54 27.69,41.66 27.94,41.91 R5.1
  Top 0.406: R7.1 29.25,34.04
AD8221
  Top 0.305: AD8221.7 40,34.42 38.73,35.69 ADTL082-IC1.3 35.18,35.69 33.91,36.96 ADTL082-IC1.5
ADC_BUSY
  Top 0.305: ATMEGA32U4.41 28.33,60.31 30.48,58.17 35.05,58.17 37.21,56.01 AD7894-10.6
ADC_CONVST
  Top 0.305: ATMEGA32U4.40 27.53,60.22 30.35,57.4 34.8,57.4 35.94,56.26 AD7894-10.7
AGND  (via drill 0.7)
  Top 0.254: U$1.SDO 23.78,51.78 25.4,50.16
  Top 0.406: AD8221.6 43.56,35.69 43.69,35.81
  other vias: 35.56,29.46 34.8,39.37 45.85,44.2 34.29,44.45 38.31,29.46 59.69,35.56 59.69,33.02 23.24,44.32 29.59,18.92 37.85,13.34
  pour Top (isolate 0.254): 17.65,52.07 51.44,52.07 51.44,54.61 63.37,54.61 63.37,9.02 1.4,9.02 1.4,35.94 17.65,35.94
  pour Bottom (isolate 0.305): 17.65,52.07 51.44,52.07 51.44,54.61 63.37,54.61 63.37,9.02 1.4,9.02 1.4,35.94 17.65,35.94
BNCVIN
  Top 0.305: ADTL082-IC1.2 ADTL082-IC1.1 37.14,26.98 34.04,23.88 R12.1
D0/RX
  Top 0.305: ATMEGA32U4.20 24.33,75.23 23.37,76.2 13.34,76.2 11.43,78.74 7.75,78.74 EXPANSION.1
D1/TX
  Top 0.305: ATMEGA32U4.21 23.53,75.02 22.99,75.57 12.7,75.57 11.3,77.47 EXPANSION.2
D2/SDA
  Top 0.305: ATMEGA32U4.19 25.13,75.58 23.88,76.84 14.1,76.84 12.06,79.5 5.84,79.5 5.08,78.74 5.08,76.33 EXPANSION.3
D3/SCL  (via drill 0.7)
  Top 0.305: v17.02,78.23 23.37,78.23 25.93,75.67 ATMEGA32U4.18
  Bottom 0.305: v17.02,78.23 13.46,78.23 10.16,74.93 EXPANSION.4
D4
  Top 0.254: 20.88,70.61 ATMEGA32U4.25
  Top 0.305: ATMEGA32U4.25 14.43,70.66 12.06,73.66 7.75,73.66 EXPANSION.5
D5  (via drill 0.7)
  Top 0.305: ATMEGA32U4.31 19.13,65.86 v17.78,64.77
  Bottom 0.305: EXPANSION.6 10.79,72.39 v17.78,64.77
D6
  Top 0.305: 20.91,69.09 ATMEGA32U4.27 15.72,69.06 11.43,64.77 8.89,64.77 7.75,65.91 7.75,68.58 EXPANSION.7
D7  (via drill 0.7)
  Top 0.305: v32.51,62.48 32.51,64.24 ATMEGA32U4.1
  Bottom 0.305: v32.51,62.48 17.78,62.48 11.05,69.85 EXPANSION.8
DAC_CLR
  Top 0.305: ATMEGA32U4.37 25.15,62.45 25.15,59.94 22.22,57.02 22.22,51.56 23.78,49.75 U$1.CLR
DAC_PD
  Top 0.305: ATMEGA32U4.38 25.91,62.44 25.91,59.56 22.86,56.52 22.86,52.07 24.43,50.24 U$1.PD
DAC_SS
  Top 0.305: ATMEGA32U4.39 26.73,58.48 25.7,57.45 25.7,54.41 U$1.SYNC
DACVIN
  Top 0.305: R15.2 C31.1 | C31.1 R12.2 | ADTL082-IC2.3 33.71,18.9 31.9,18.9 31.5,19.3 C31.1
GND  (via drill 0.6, 0.7, 3.2)
  Top 0.305: ATMEGA32U4.23 22.35,72.26 22.86,71.76 | ATMEGA32U4.15 28.33,72.15 27.94,71.76 | 29.72,64.39 30.01,64.22 C3.2 | 23.49,64.77 23.49,62.87 23.53,62.83 ATMEGA32U4.35 | U$1.LDAC 27.03,54.98
  Top 0.406: 55.75,56.8 RESET.3
  Top 0.61: 55.84,58.46 53.34,60.96 50.29,60.96 | 55.88,57.15 55.84,57.11 RESET.3 55.88,56.39
  Top 1.27: USB.S1 USB.S2 51.27,70.32
  Bottom 0.406: MEA1D0512SC.2 5.71,27.94 7.62,29.84 7.62,32.35 C34.2 C10.2 5.93,35.77 v8.25,38.1 8.89,38.73
  Bottom 1.27: 51.27,70.32 USB.S2 | 58.55,82.3 58.55,88.01
  other vias: 16.56,61.59 32.89,59.31 46.1,76.2 48.26,80.65 29.84,54.23 58.67,65.66 53.59,61.09 35.81,80.26 5.08,43.18 25.15,65.53 3.81,92.71 60.96,92.71 6.4,48.26 15.88,46.99 58.67,57.15
  pour Top (isolate 0.254): 16.64,53.09 50.42,53.09 50.42,55.63 63.37,55.63 63.37,67.56 51.56,67.56 51.56,85.85 63.37,85.85 63.37,96.52 1.4,96.52 1.4,36.96 16.64,36.96
  pour Bottom (isolate 0.254): 1.4,96.52 63.37,96.52 63.37,85.85 51.56,85.85 51.56,67.56 63.37,67.56 63.37,55.63 50.42,55.63 50.42,53.09 16.64,53.09 16.64,36.96 1.4,36.96
HWB
  Top 0.305: ATMEGA32U4.33 20.93,62.93 R2.1
IO12  (via drill 0.7)
  Top 0.254: ATMEGA32U4.26
  Top 0.406: ATMEGA32U4.26 15.24,69.85 v11.43,66.04 | v14.6,49.11 R22.1
  Bottom 0.406: v14.6,49.11 14.6,62.23 11.43,65.41 v11.43,66.04
IO13
  Top 0.406: ATMEGA32U4.32 19.34,65.06 19.05,64.77 19.05,59.69 8.25,48.89 R18.1
MISO  (via drill 0.7)
  Top 0.305: AD7894-10.5 38.48,55.75 36.58,57.66 36.58,60.71 39.24,63.37 ICSP.1 | v33.91,73.66 33.91,72.64 33.53,72.26 ATMEGA32U4.11
  Bottom 0.305: ICSP.1 39.24,68.33 v33.91,73.66
MOSI  (via drill 0.7)
  Top 0.305: ATMEGA32U4.10 33.62,71.46 v35.56,73.41 | U$1.SDIN 26.38,56.49 27.05,57.15 v28.27,57.15
  Bottom 0.305: v28.27,57.15 29.21,57.15 30.99,55.12 38.99,55.12 40.51,56.64 40.51,61.09 | 40.51,61.09 40.51,68.45 v35.56,73.41 | ICSP.4 40.51,61.09
N$1
  Top 0.305: ADTL082-IC2.2 39.95,20.16 R16.2 39.2,20.57 36.45,20.57 36.32,20.7 R17.2
N$2
  Top 0.305: C32.1 44.9,14.99 44.9,17.55 44.83,17.62 | 44.83,17.62 44.48,17.62 44.2,17.91 44.2,22.35 43.56,22.99 43.56,24.18 R14.2 | 44.83,17.62 ADTL082-IC2.5
N$3
  Top 0.305: 35.94,44.7 35.94,43.81 34.16,42.04 34.04,41.91 | 35.94,44.7 AD7894-10.2 | 35.94,44.7 C4.1
  Top 0.406: R24.2 34.16,41.91 34.16,42.04
N$4
  Top 0.305: C23.1 45.89,33.11 45.72,33.27 46.18,33.27 AD8221.1 48.56,33.15 C22.1 49.66,34.16 50.8,33.02 R11.1
N$5
  Top 0.305: R24.1 R5.2
N$6
  Top 0.813: MEA1D0512SC.6 8.78,17.78 L3.P$1
N$7
  Top 0.305: 41.4,22.61 41.4,21.46 42.2,21.46 ADTL082-IC2.1 | 41.4,22.61 R13.1 | R16.1 39.37,22.73 41.27,22.73 41.4,22.61
N$8
  Top 0.305: 27.66,48.41 U$1.VOUT | R15.1 28.83,23.88
  Top 0.406: 27.66,48.41 27.66,46.2 22.86,41.4 22.86,29.84 28.83,23.88
N$9
  Top 0.305: 60.65,65.5 TX.ANODE
  Top 0.406: R19.1 60.65,65.5
N$10
  Top 0.305: ATMEGA32U4.4 36.19,66.68 42.42,72.9 R4.1
N$11
  Top 0.305: C9.2 23.88,81.62 16MHZ.1 26.33,79.18 R6.1 26.73,76.56 ATMEGA32U4.17
N$12
  Top 0.305: RX.ANODE 60.45,57.88 R20.1
N$13
  Top 0.305: BNC-IN.GND 55.63,49.78 57.66,47.75 57.66,46.23 55.88,44.45 55.88,34.29 54.86,33.02 R11.2
N$14
  Top 0.305: C19.2 45.89,37 45.72,36.83 46.18,36.83 AD8221.4 48.65,36.96 C22.2 50.79,37.08 R9.1
N$15
  Top 0.305: ATMEGA32U4.6 35.88,68.26 41.02,73.41 41.02,74.68 42.55,76.2 42.55,79.38 42.89,79.72 C5.1
N$16
  Top 0.305: R13.2 41.39,26.15 41.53,26.29 43.56,26.29 | 43.56,26.29 45.65,26.29 C29.2 | R14.1 43.66,26.19 43.56,26.29
N$17
  Top 0.305: 54.1,47.24 BNC-IN.S | 54.1,47.24 53.09,46.23 53.09,41.91 | 54.1,47.24 | 53.09,41.91 R10.2 | 53.09,41.91 53.09,37.43 R9.2
N$18
  Top 0.305: ADTL082-IC1.6 30.1,35.69 29.72,36.07 29.25,36.07 | R7.2 28.96,39.12 29.21,39.37 R8.2
  Top 0.406: R7.2 29.25,36.07
N$19  (via drill 0.7)
  Top 0.305: v48.77,71.12 R3.2 44.54,69.91 Z1.2
  Bottom 0.305: v48.77,71.12 48.77,74.17 49.69,75.09 USB.D-
N$20
  Top 0.305: ATMEGA32U4.3 36.4,65.86 41.66,71.12 R3.1
N$21
  Top 0.305: USB.D+ 55.86,73.9 54.86,72.9 R4.2 44.54,74.11 Z2.2
  Top 0.406: R4.2 44.55,72.91
N$22
  Top 1.27: USB.VBUS 53.88,82.26 53.09,83.06 52.15,83.06 F1.1
N$23
  Top 0.305: 47.48,20.11 ADTL082-IC2.7 | C29.1 45.47,19.18 45.75,18.89 ADTL082-IC2.6 48.35,18.89 48.39,18.92 48.39,20.07 48.26,20.19 47.56,20.19 47.48,20.11 | 47.48,20.11 53.85,20.11 BNC-OUT.S
N$24
  Top 0.305: ON.ANODE 60.45,61.69 R21.1
N$25  (via drill 0.7)
  Top 0.305: C3.1 35.05,60.45 36.07,61.47 L1.1 | 32,60.74 C3.1 | 21.02,71.37 ATMEGA32U4.24 19.98,71.46 v18.8,72.64 | v29.84,65.41 30.73,64.52 ATMEGA32U4.44 30.88,62.46 31.75,61.59 31.75,60.49 C3.1
  Bottom 0.305: v18.8,72.64 22.61,72.64 v29.84,65.41
N$26
  Top 0.305: C11.2 30.47,81.62 16MHZ.2 28.03,79.18 R6.2 27.53,76.47 ATMEGA32U4.16
N$28
  Top 0.254: ATMEGA32U4.12 31.52,74.06 IO11.P$1
N$29
  Top 0.406: COM-07844.R 7.39,45.27 R18.2
N$30
  Top 0.406: COM-07844.B 11.59,38.73 14.6,38.73 15.24,39.37 15.24,42.55 13.97,43.81 R22.2
N$31
  Top 0.406: 10.79,41.27 10.45,41.27 COM-07844.G 10.79,41.74 10.79,43.18 11.63,44.02 R23.2
RESET  (via drill 0.7)
  Top 0.305: ATMEGA32U4.13 29.97,74.1 29.97,74.6 29.93,74.64 29.93,74.89 31.24,76.2 v34.29,76.2 | D1.A 48.77,62.31 | RESET.1 51.08,57.15 | D1.A 48.69,64.34 47.5,65.53 v44.96,65.53 | ICSP.5 39.24,58.93 40,59.82 v43.81,59.82 | D1.A 48.69,61.17 R1.2 48.89,59.82 51.34,57.24
  Top 0.406: RESET.1 51.34,57.24
  Bottom 0.305: v34.29,76.2 v44.96,65.53 43.81,64.14 v43.81,59.82
RXLED  (via drill 0.7)
  Top 0.406: ATMEGA32U4.8 35.18,69.85 38.48,73.15 v38.48,73.79 | RX.CATHODE 62.58,59.98 61.72,60.83 59.18,60.83 v58.42,61.59
  Bottom 0.406: v38.48,73.79 43.94,68.33 56.13,68.33 57.15,67.31 57.15,62.87 v58.42,61.59
SCK  (via drill 0.7)
  Top 0.305: 38.35,51.05 25.65,51.05 24.43,52.27 U$1.SCLK | 38.35,51.05 38.61,51.05 40.39,52.83 40.39,54.86 37.34,57.91 37.34,60.45 37.97,61.09 ICSP.3 | AD7894-10.4 38.48,50.93 38.35,51.05 | ATMEGA32U4.9 34.21,70.66 v34.8,71.12
  Bottom 0.305: ICSP.3 37.08,63.25 35.31,63.25 34.8,63.75 v34.8,71.12
TSL1401R_AO
  Top 0.305: ATMEGA32U4.30 18.4,66.66 9.52,57.78 9.52,52.7 6.35,49.43 SENSOR.P$2
TSL1401R_CLK
  Top 0.305: ATMEGA32U4.29 17.3,67.46 8.25,58.42 8.25,53.34 6.35,51.44 SENSOR.P$3
TSL1401R_SI
  Top 0.305: ATMEGA32U4.28 16.19,68.26 6.98,59.05 6.98,53.98 6.45,53.44 SENSOR.P$4
TXLED  (via drill 0.7)
  Top 0.406: v19.94,73.91 22.59,73.91 ATMEGA32U4.22 | TX.CATHODE 62.74,67.85 v62.74,69.22
  Bottom 0.406: v19.94,73.91 19.3,73.91 18.8,74.42 18.8,83.57 19.81,84.58 50.8,84.58 51.44,83.95 51.44,80.14 52.07,79.38 62.23,79.38 62.74,78.87 v62.74,69.22
UGND
  Top 0.305: ATMEGA32U4.5 35.97,67.46 36.09,67.46 41.78,73.15 41.78,74.17 43.69,76.07 C5.2 43.69,77.98 43.94,77.72 45.93,77.72 L2.2 | USB.GND 55.86,77.45 54.74,76.33 48.64,76.33 47.2,77.77 L2.2 | 45.85,78.02 L2.2
(copper drawn outside any net)
  shapes: Top area x2

### Text on the board
tPlace: Karl Bellve, | Biomedical Imaging Group | Program in Molecular Medicine | University of Massachusetts Medical School | 0 | 1 | 2 | 3 | 4 | 5 | 6 | 7 | TX | 5V | GND | Sensor | GND | * | SI | * | CLK | AO | * | 5V | GND | AGND | * | * | (Optional) | * | 47uH | +12V/-12V Power Supply | Karl.Bellve@umassmed.edu | pgFocus | Copyright 2015
bPlace: Credits | Biomedical Imaging Group | Kevin Fogarty | Karl Bellve | Lawrence Lifshitz | Molecular Medicine | Silvia Corvera | Deborah Leonard | Mike Czech | Advice | Michael Brenegan | Paul Tilander | Special thanks | Arduino Team | Sparkfun Electronics | Adafruit Industries | Parallax Inc | June 25 2015
tNames: IO11
bNames: Copyright 2013
bValues: Thank you